# Altium schematic sheet P03_BCS1_USB, Serial, uSD.SchDoc
size A3; Date: 24.11.2011; CheckedBy: Finke; Author: Mierau; DrawnBy: Mierau; SheetNumber: 3; SheetTotal: 8; Anlage: 78; Beschreibung: Qseven; Kunde: 56; ProjektName: BCS1; ProjektNummer: 88xxx; Ersatz_fuer: 12; ersetzt_durch: 34; LKNummer: 6190202; ID_Nummer: 90
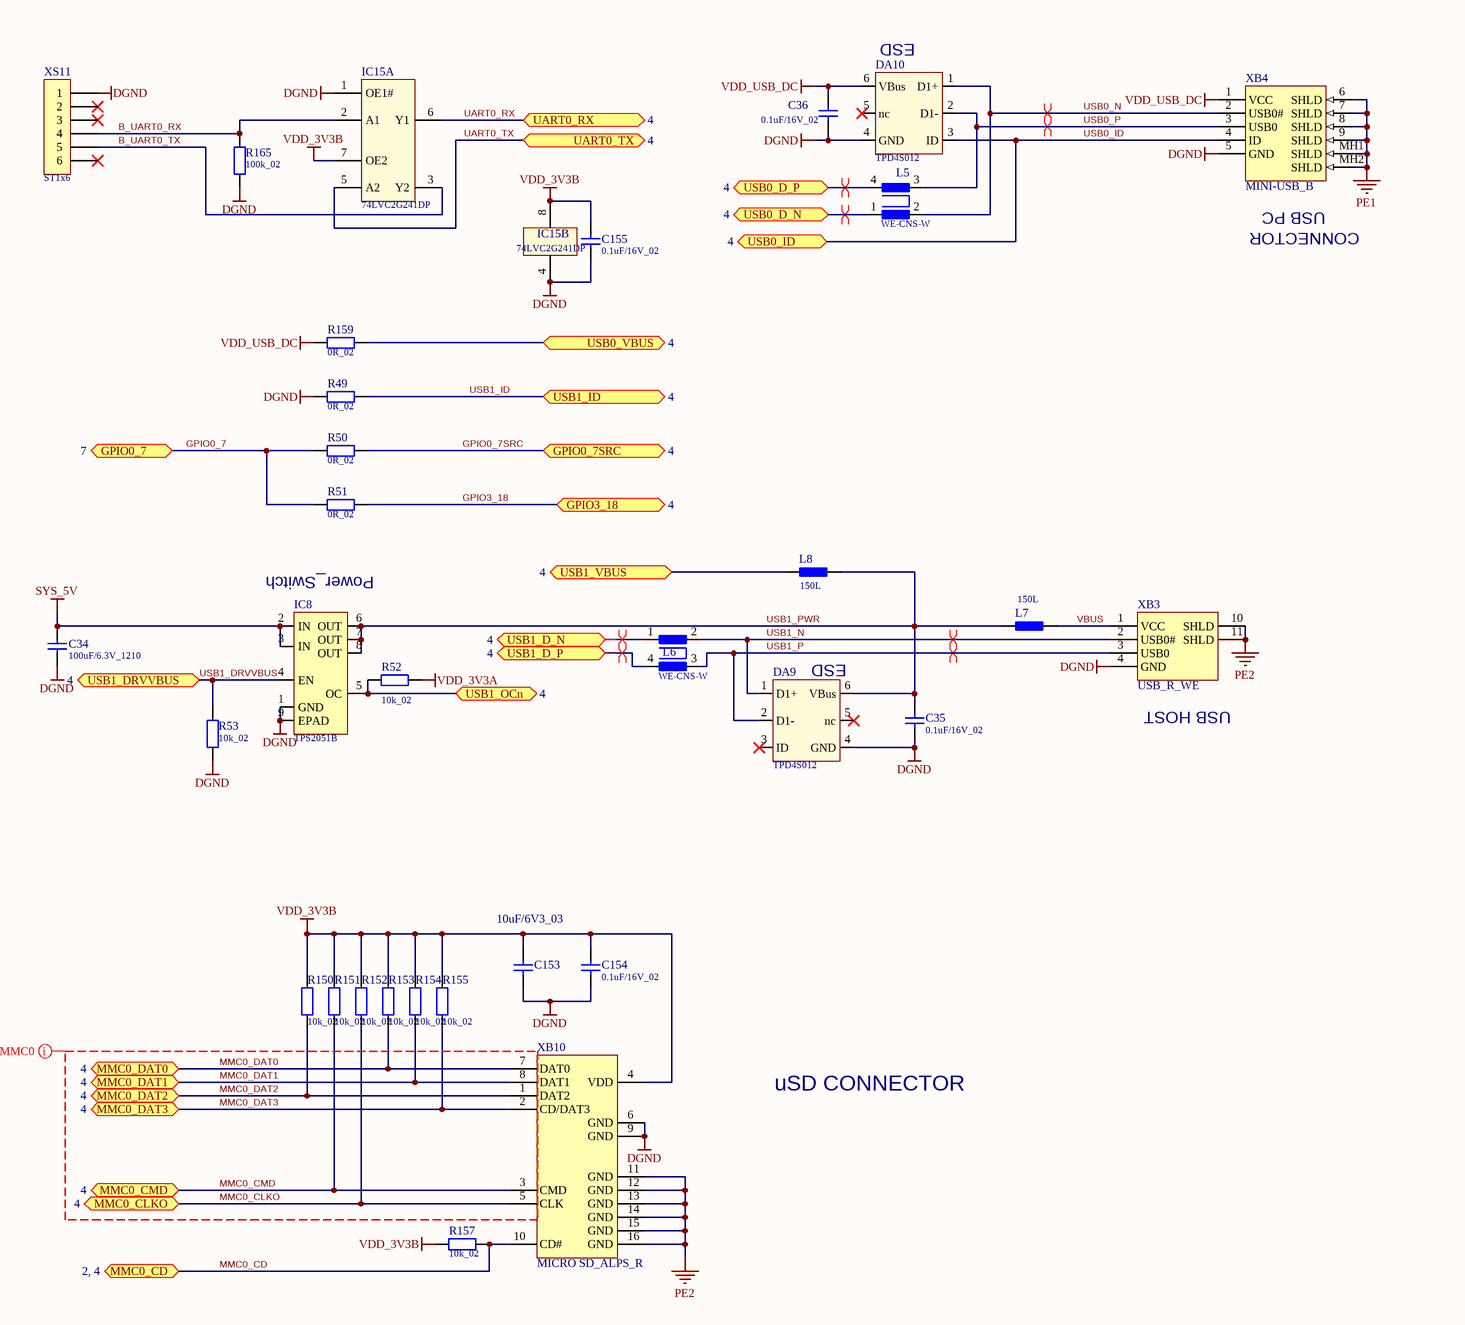
[diagram p0: P03_BCS1_USB, Serial, uSD.SchDoc]

## Parts
C34  100uF/6.3V_1210  [CC3225-1210]
C35  0.1uF/16V_02  [CC1005-0402]
C36  0.1uF/16V_02  [CC1005-0402]
C153  10uF/6V3_03  [CC1608-0603]
C154  0.1uF/16V_02  [CC1005-0402]
C155  0.1uF/16V_02  [CC1005-0402]
DA9  TPD4S012  [SON6]
DA10  TPD4S012  [SON6]
IC8  TPS2051B  [DGN-MSOP8+1]
IC15  74LVC2G241DP  [TSSOP8 - 3x3]  (parts A,B of 2)
L5  WE-CNS-W  [WE-CNS_W - 0805]
L6  WE-CNS-W  [WE-CNS_W - 0805]
L7  150L  [CR2012-0805]
L8  150L  [CR2012-0805]
R49  0R_02  [CR1005-0402]
R50  0R_02  [CR1005-0402]
R51  0R_02  [CR1005-0402]
R52  10k_02  [CR1005-0402]
R53  10k_02  [CR1005-0402]
R150  10k_02  [CR1005-0402]
R151  10k_02  [CR1005-0402]
R152  10k_02  [CR1005-0402]
R153  10k_02  [CR1005-0402]
R154  10k_02  [CR1005-0402]
R155  10k_02  [CR1005-0402]
R157  10k_02  [CR1005-0402]
R159  0R_02  [CR1005-0402]
R165  100k_02  [CR1005-0402]
XB3  USB_R_WE  [61400416021]
XB4  MINI-USB_B  [USB-MINI-B]
XB10  MICRO SD_ALPS_R  [Micro-SD-Card-Conn-ALPS- Reverse Mount]
XS11  ST1x6  [ST6]

## Ports
GPIO0_7 (see 7), GPIO0_7SRC (bidir, see 4), GPIO3_18 (bidir, see 4), MMC0_CD (see 2, 4), MMC0_CLKO (see 4), MMC0_CMD (see 4), MMC0_DAT0 (see 4), MMC0_DAT1 (see 4), MMC0_DAT2 (see 4), MMC0_DAT3 (see 4), UART0_RX (see 4), UART0_TX (see 4), USB0_D_N (bidir, see 4), USB0_D_P (bidir, see 4), USB0_ID (see 4), USB0_VBUS (see 4), USB1_D_N (bidir, see 4), USB1_D_P (bidir, see 4), USB1_DRVVBUS (see 4), USB1_ID (see 4), USB1_OCn (see 4), USB1_VBUS (see 4)

## Nets
DGND: C34.1 C35.2 C36.2 C153.1 C154.1 C155.2 DA9.4(GND) DA10.4(GND) IC8.1(GND) IC8.9(EPAD) IC15.1(OE1#) IC15.4(GND) R49.1 R53.1 R165.1 XB3.4(GND) XB4.5(GND) XB10.6(GND) XB10.9(GND) XS11.1
PE1: XB4.6(SHLD) XB4.7(SHLD) XB4.8(SHLD) XB4.9(SHLD) XB4.MH1(SHLD) XB4.MH2(SHLD)
PE2: XB3.10(SHLD) XB3.11(SHLD) XB10.11(GND) XB10.12(GND) XB10.13(GND) XB10.14(GND) XB10.15(GND) XB10.16(GND)
SYS_5V: C34.2 IC8.2(IN) IC8.3(IN)
VDD_3V3A: R52.2
VDD_3V3B: C153.2 C154.2 C155.1 IC15.7(OE2) IC15.8(VDD) R150.1 R151.1 R152.1 R153.1 R154.1 R155.1 R157.1 XB10.4(VDD)
VDD_USB_DC: C36.1 DA10.6(VBus) R159.1 XB4.1(VCC)
B_UART0_RX: IC15.2(A1) R165.2 XS11.4
B_UART0_TX: IC15.3(Y2) XS11.5
GPIO0_7: R50.1 R51.1 ; port GPIO0_7
GPIO0_7SRC: R50.2 ; port GPIO0_7SRC
GPIO3_18: R51.2 ; port GPIO3_18
MMC0_CD: R157.2 XB10.10(CD#) ; port MMC0_CD
MMC0_CLKO: R152.2 XB10.5(CLK) ; port MMC0_CLKO
MMC0_CMD: R151.2 XB10.3(CMD) ; port MMC0_CMD
MMC0_DAT0: R153.2 XB10.7(DAT0) ; port MMC0_DAT0
MMC0_DAT1: R154.2 XB10.8(DAT1) ; port MMC0_DAT1
MMC0_DAT2: R150.2 XB10.1(DAT2) ; port MMC0_DAT2
MMC0_DAT3: R155.2 XB10.2(CD/DAT3) ; port MMC0_DAT3
UART0_RX: IC15.6(Y1) ; port UART0_RX
UART0_TX: IC15.5(A2) ; port UART0_TX
USB0_D_N: L5.1 ; port USB0_D_N
USB0_D_P: L5.4 ; port USB0_D_P
USB0_ID: DA10.3(ID) XB4.4(ID) ; port USB0_ID
USB0_N: DA10.1(D1+) L5.2 XB4.2(USB0#)
USB0_P: DA10.2(D1-) L5.3 XB4.3(USB0)
USB0_VBUS: R159.2 ; port USB0_VBUS
USB1_D_N: L6.1 ; port USB1_D_N
USB1_D_P: L6.4 ; port USB1_D_P
USB1_DRVVBUS: IC8.4(EN) R53.2 ; port USB1_DRVVBUS
USB1_ID: R49.2 ; port USB1_ID
USB1_N: DA9.1(D1+) L6.2 XB3.2(USB0#)
USB1_OCn: IC8.5(OC) R52.1 ; port USB1_OCn
USB1_P: DA9.2(D1-) L6.3 XB3.3(USB0)
USB1_PWR: C35.1 DA9.6(VBus) IC8.6(OUT) IC8.7(OUT) IC8.8(OUT) L7.1 L8.2
USB1_VBUS: L8.1 ; port USB1_VBUS
VBUS: L7.2 XB3.1(VCC)

Not connected (* = marked no-connect by the designer): DA9 3(ID)* 5(nc)*; DA10 5(nc)*; XS11 2* 3* 6*

## Layout directives
differential pair: USB0_D_N, USB0_D_P, USB0_N, USB0_P, USB1_D_N, USB1_D_P, USB1_N, USB1_P
net class MMC0: MMC0_CLKO, MMC0_CMD, MMC0_DAT0, MMC0_DAT1, MMC0_DAT2, MMC0_DAT3

## Notes on the sheet
- (near DA10) ESD
- (near XB4) USB PC
- CONNECTOR
- (near IC8) Power_Switch
- (near DA9) ESD
- (near XB3) USB HOST
- uSD CONNECTOR
- Date
- Name
- REV.:
- editor:
- CAD:
- - SL (3)
- sheet:
- LK :
- checked:
- of:

## Library data of the parts
C34 = C100uF/6.3V_10: Capacitor 1210; 6.3V; Hersteller: Murata; Bestellbezeichnung: GRM32ER60J107ME20; Value: 100uF/6.3V_1210
C35 C36 C154 C155 = C0.1uF/16V_02: Capacitor 0402 16V Y5V; Value: 0.1uF/16V_02
C153 = C10uF/6V3_03: Capacitor 0603 6V3; 10%, X5R; Value: 10uF/6V3_03
DA9 DA10 = DATPD4S012: Diode Array TVS,  for USB2.0 TypB; 4fach; Hersteller: TI; Bestellbezeichnung: TPD4S012; Value: TPD4S012
IC8 = ICTPS2051B: Current-Limited PowerSwitch; Hersteller: ti; Bestellbezeichnung: TPS2051BDGNR; Value: TPS2051B
IC15 = IC74LVC2G241DP: dual buffer/line driver; 3-state, 5V-tolerant; Hersteller: NXP; Bestellbezeichnung: 74LVC2G241DP; Value: 74LVC2G241DP
L5 L6 = LWE-CNS FILTER: Stromkomp. Datenleitungsfilter WE-CNS-W, 90 Ohm; Hersteller: Würth Elektronik; Bestellbezeichnung: 744231091; Value: WE-CNS-W
L7 L8 = L150 Ohm Ferrite: Inductor 120 Ohm Ferrite 0805, 800mA; Hersteller: Laird-Signal Integrity Products; Bestellbezeichnung: LI0805H151R-10; Value: 150L
R49-R51 R159 = R0R_02: Resistor 0402; Value: 0R_02
R52 R53 R150-R155 R157 = R10k_02: Resistor 0402; Value: 10k_02
R165 = R100k_02: Resistor 0402; Value: 100k_02
XB3 = XBUSB_R_WE: USB einfach RA Type A; Hersteller: Würth; Bestellbezeichnung: 61400416021; Value: USB_R_WE
XB4 = XBUSB_Mini-B: USB MINI Typ B einfach 5pol.; Hersteller: Molex; Bestellbezeichnung: 0513870530; Value: MINI-USB_B
XB10 = XBMICRO_SD_ALPS_R: MICRO SD Memory card connector push/push  reverse mount ALPS (SCHA5B0200); Hersteller: ALPS; Bestellbezeichnung: SCHA5B0200; Value: MICRO SD_ALPS_R
XS11 = XST1X6: Modul-Stiftleiste 2.54mm pitch einreihig, 6pol.; Value: ST1x6